# EAGLE design Sop16 (EAGLE 9.5.1)
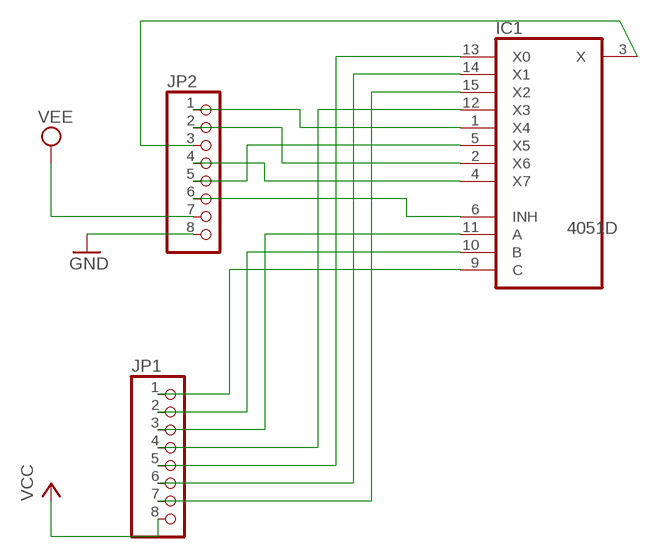
[diagram p0: schematic, sheet 1]

## Parts
IC1  4051D  [SO16]
JP1  PINHD-1X8  [1X08]
JP2  PINHD-1X8  [1X08]

## Nets
GND: JP2.8
N$1: IC1.1(X4) JP2.1
N$2: IC1.2(X6) JP2.2
N$3: IC1.3(X) JP2.3
N$4: IC1.4(X7) JP2.4
N$5: IC1.5(X5) JP2.5
N$6: IC1.6(INH) JP2.6
N$7: IC1.9(C) JP1.1
N$8: IC1.10(B) JP1.2
N$9: IC1.11(A) JP1.3
N$10: IC1.12(X3) JP1.4
N$11: IC1.13(X0) JP1.5
N$12: IC1.14(X1) JP1.6
N$13: IC1.15(X2) JP1.7
VCC: JP1.8
VEE: JP2.7

## Power pins joined to a net without a drawn wire
GND: IC1.8(GND)
VCC: IC1.16(VCC)
VEE: IC1.7(VEE)

## Library data of the parts
IC1 = 40xx:4051: 8-channel ANALOG MULTIPLEXER
JP1 JP2 = pinhead:PINHD-1X8: PIN HEADER

## Board
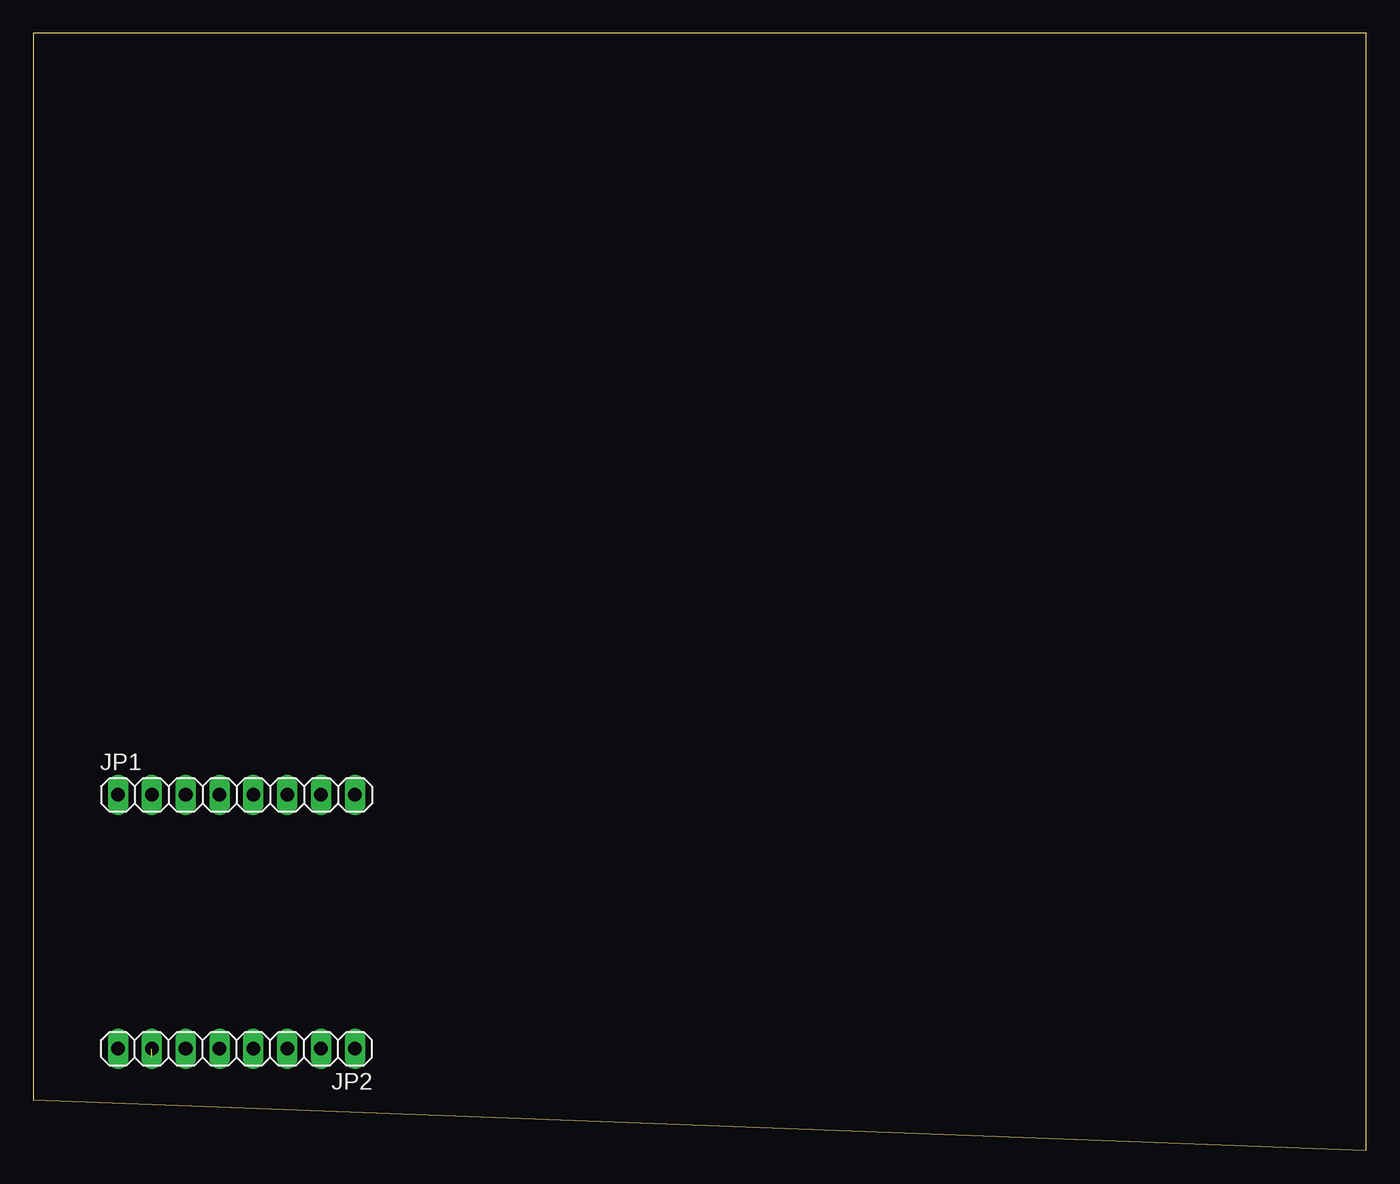
[diagram p1: board, top side]
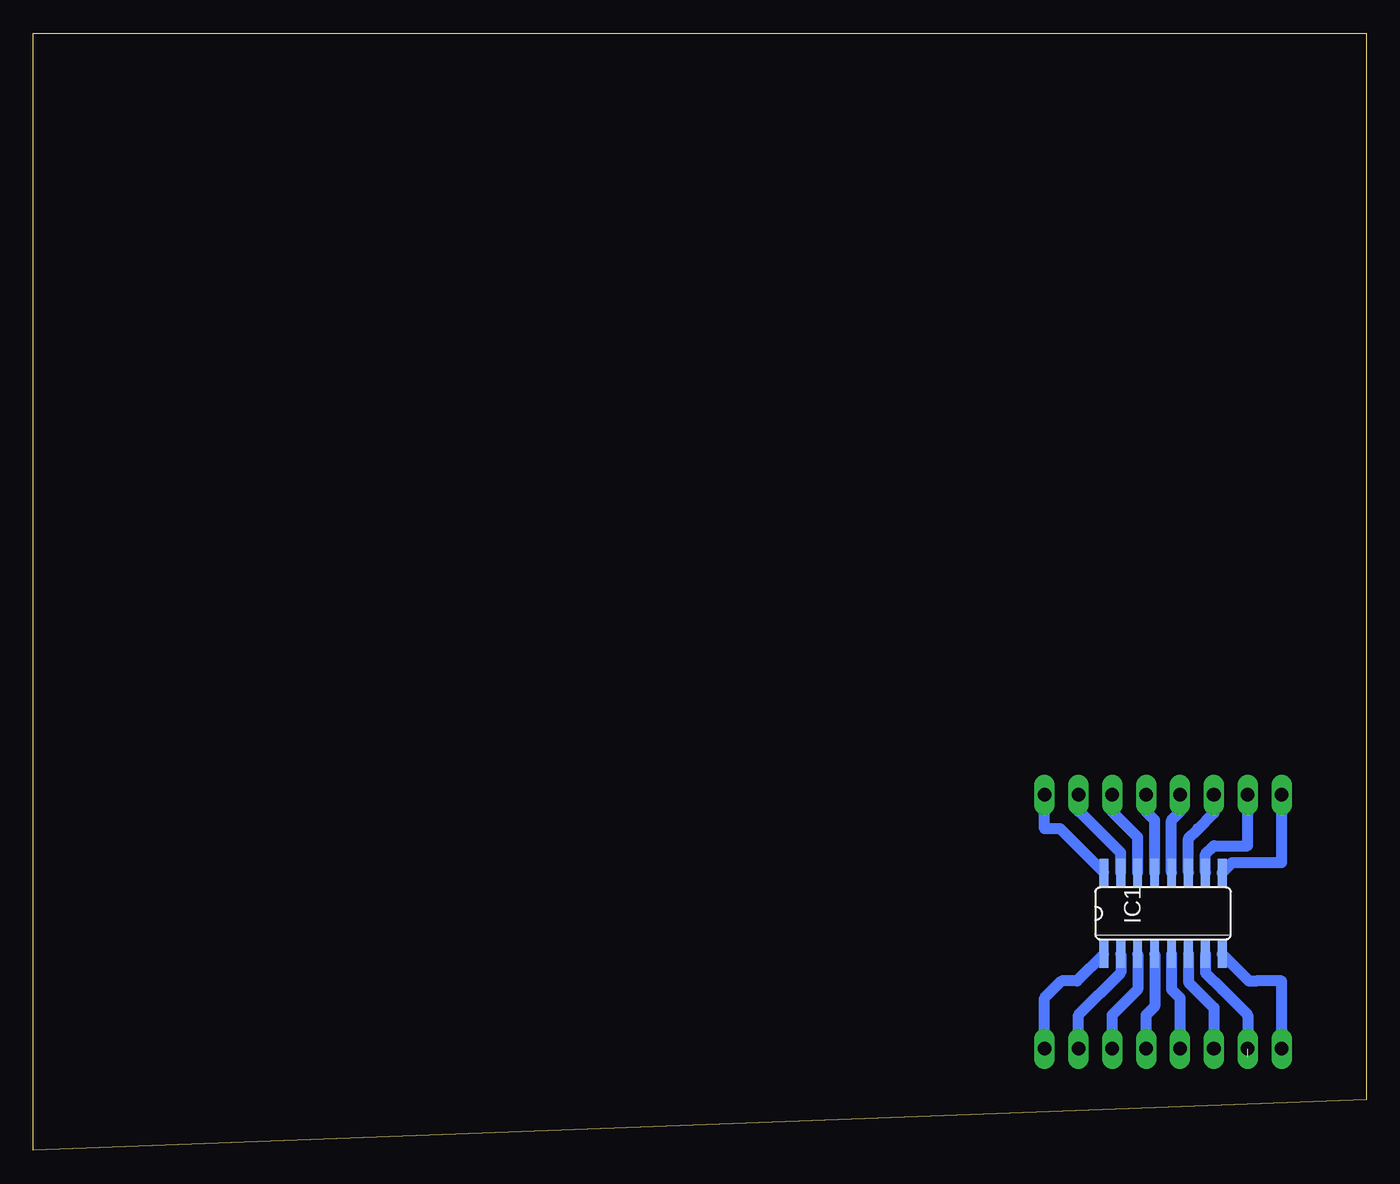
[diagram p2: board, bottom side, seen from below]

Size 100 x 83.81 mm. Coordinates in mm from the lower left corner, seen from the top.
Outline: 0,3.81 100,0 100,83.81 0,83.81 0,3.81
Copper layers (1*16): Top 0.035mm / dielectric 1.5mm / Bottom 0.035mm
Design rules "default": minimum track width 6mil, minimum drill 0.35mm, track to track 6mil, track to pad 6mil, pad to pad 6mil, via to via 6mil, smd to smd 6mil, copper to edge 40mil, drill to drill 6mil, minimum pad ring 10mil, minimum via ring 8mil, stop-mask expansion 4mil, vias tented up to drill 0mil, thermal gap 10mil

### Footprints (pad centres in the part's own frame; a part is rotated, then mirrored left to right if it is on the bottom)
SO16 = smd 0.66 x 2.032: 1 -4.445,-3.073; 2 -3.175,-3.073; 3 -1.905,-3.073; 4 -0.635,-3.073; 5 0.635,-3.073; 6 1.905,-3.073; 7 3.175,-3.073; 8 4.445,-3.073; 9 4.445,3.073; 10 3.175,3.073; 11 1.905,3.073; 12 0.635,3.073; 13 -0.635,3.073; 14 -1.905,3.073; 15 -3.175,3.073; 16 -4.445,3.073
1X08 = drill 1.016 long: 1 -8.89,0; 2 -6.35,0; 3 -3.81,0; 4 -1.27,0; 5 1.27,0; 6 3.81,0; 7 6.35,0; 8 8.89,0

### Placement (x,y rotation side)
IC1  15.24,17.78 0 bottom
JP1  15.24,26.67 0 top
JP2  15.24,7.62 180 top

### Tracks (layer width: path | path; a pad name or v marks a point on that pad's centre or on a via)
GND
  Bottom 0.813: JP2.8 6.35,12.7 8.26,12.7 8.79,12.7 IC1.8
N$1
  Bottom 0.813: IC1.1 21.69,12.7 22.86,12.7 24.13,11.43 JP2.1
N$2
  Bottom 0.813: IC1.2 18.41,13.34 21.59,10.16 JP2.2
N$3
  Bottom 0.813: IC1.3 17.14,12.07 19.05,10.16 JP2.3
N$4
  Bottom 0.813: JP2.4 16.51,10.16 15.88,10.79 IC1.4
N$5
  Bottom 0.813: 13.97,8.89 JP2.5 13.97,11.43 14.61,12.07 IC1.5
N$6
  Bottom 0.813: 11.43,8.89 JP2.6 11.43,10.7 13.34,12.61 IC1.6
N$7
  Bottom 0.813: JP1.1 6.35,21.59 10.06,21.59 IC1.9
N$8
  Bottom 0.813: IC1.10 12.06,22.22 11.43,22.86 8.89,22.86 JP1.2
N$9
  Bottom 0.813: IC1.11 13.34,23.4 12.65,24.09 | 12.65,24.09 12.65,24.13 | 12.65,24.09 11.43,25.31 JP1.3
N$10
  Bottom 0.813: IC1.12 14.61,24.76 13.97,25.4 JP1.4
N$11
  Bottom 0.813: IC1.13 15.88,24.76 16.51,25.4 JP1.5
N$12
  Bottom 0.813: IC1.14 17.14,23.49 19.05,25.4 JP1.6
N$13
  Bottom 0.813: IC1.15 18.41,22.32 21.5,25.4 21.59,25.4 JP1.7
VCC
  Bottom 0.813: IC1.16 22.96,24.13 24.13,24.13 JP1.8
VEE  (1 unrouted)
  Bottom 0.813: IC1.7 12.06,13.34 10.79,12.07 8.89,10.16 8.89,6.98